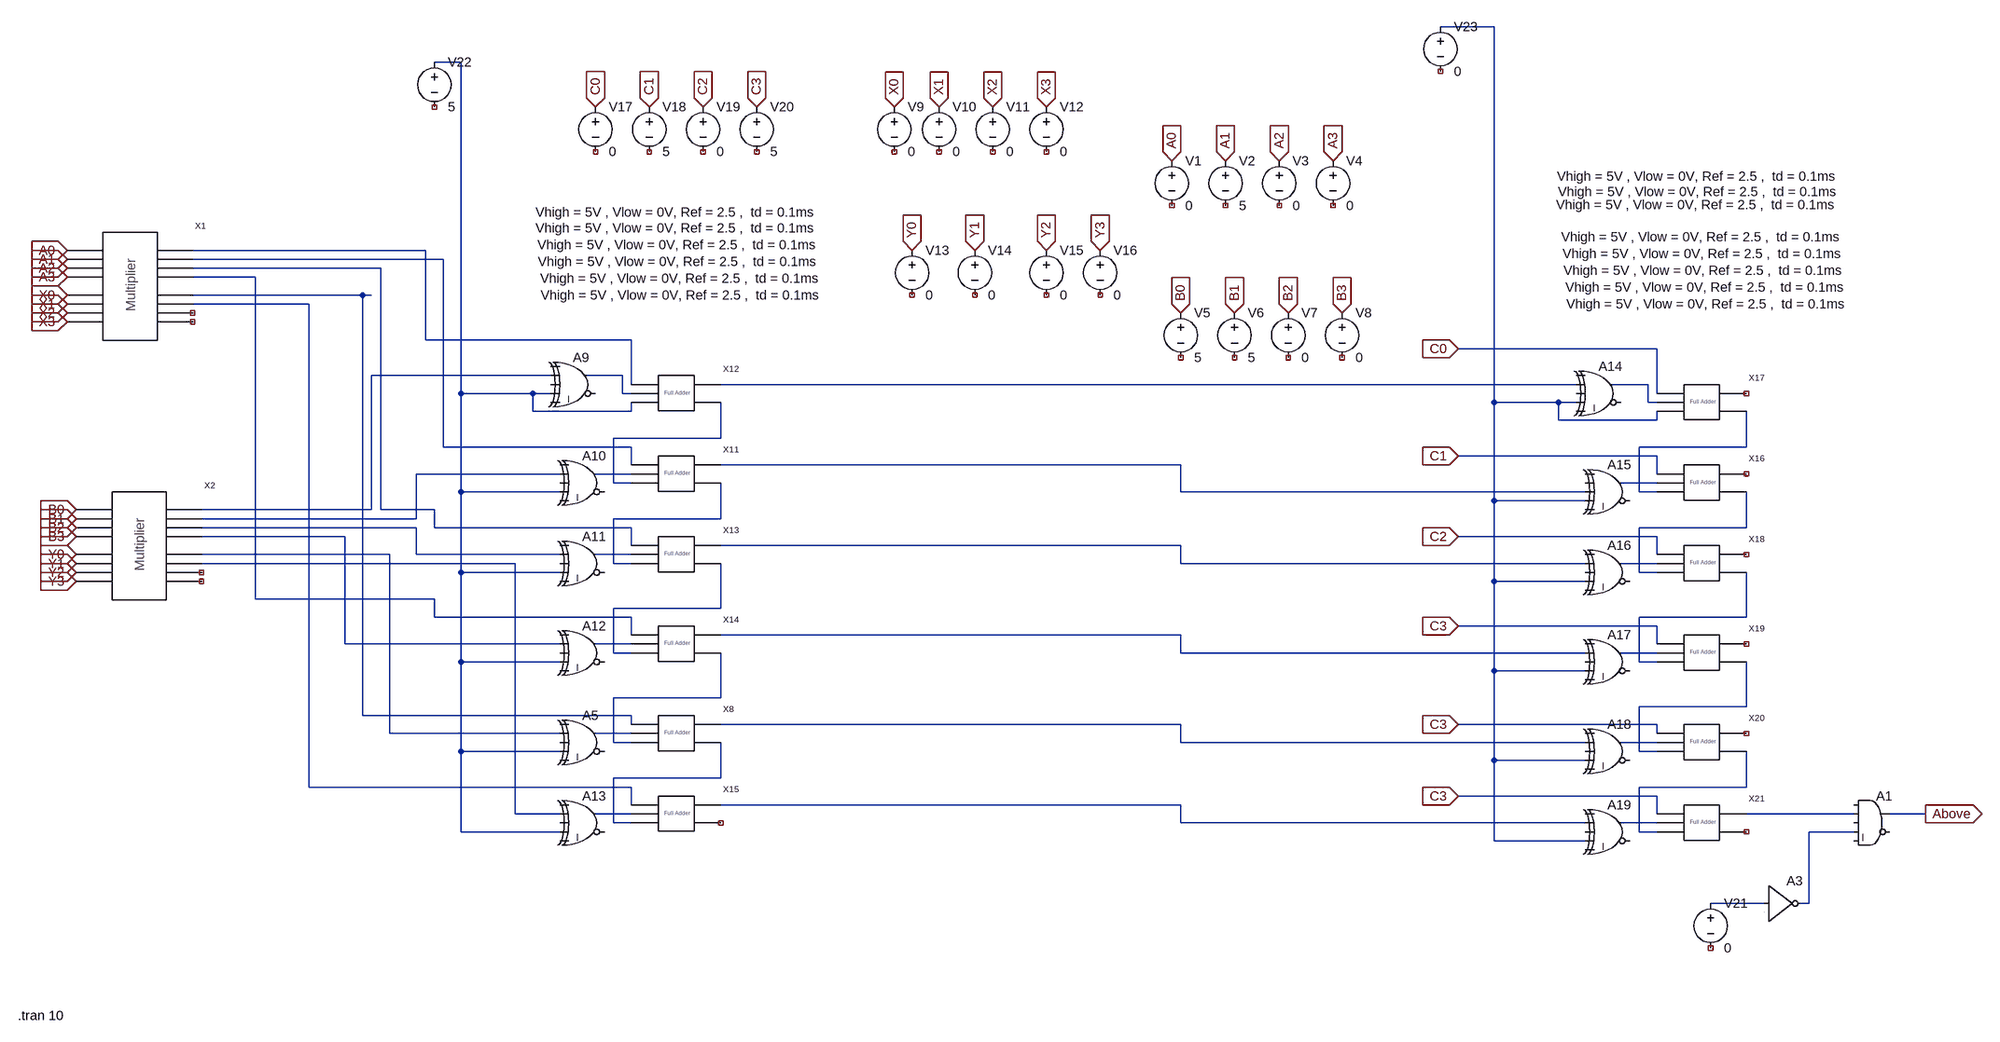
[diagram p0: schematic pattern_recognation.asc]
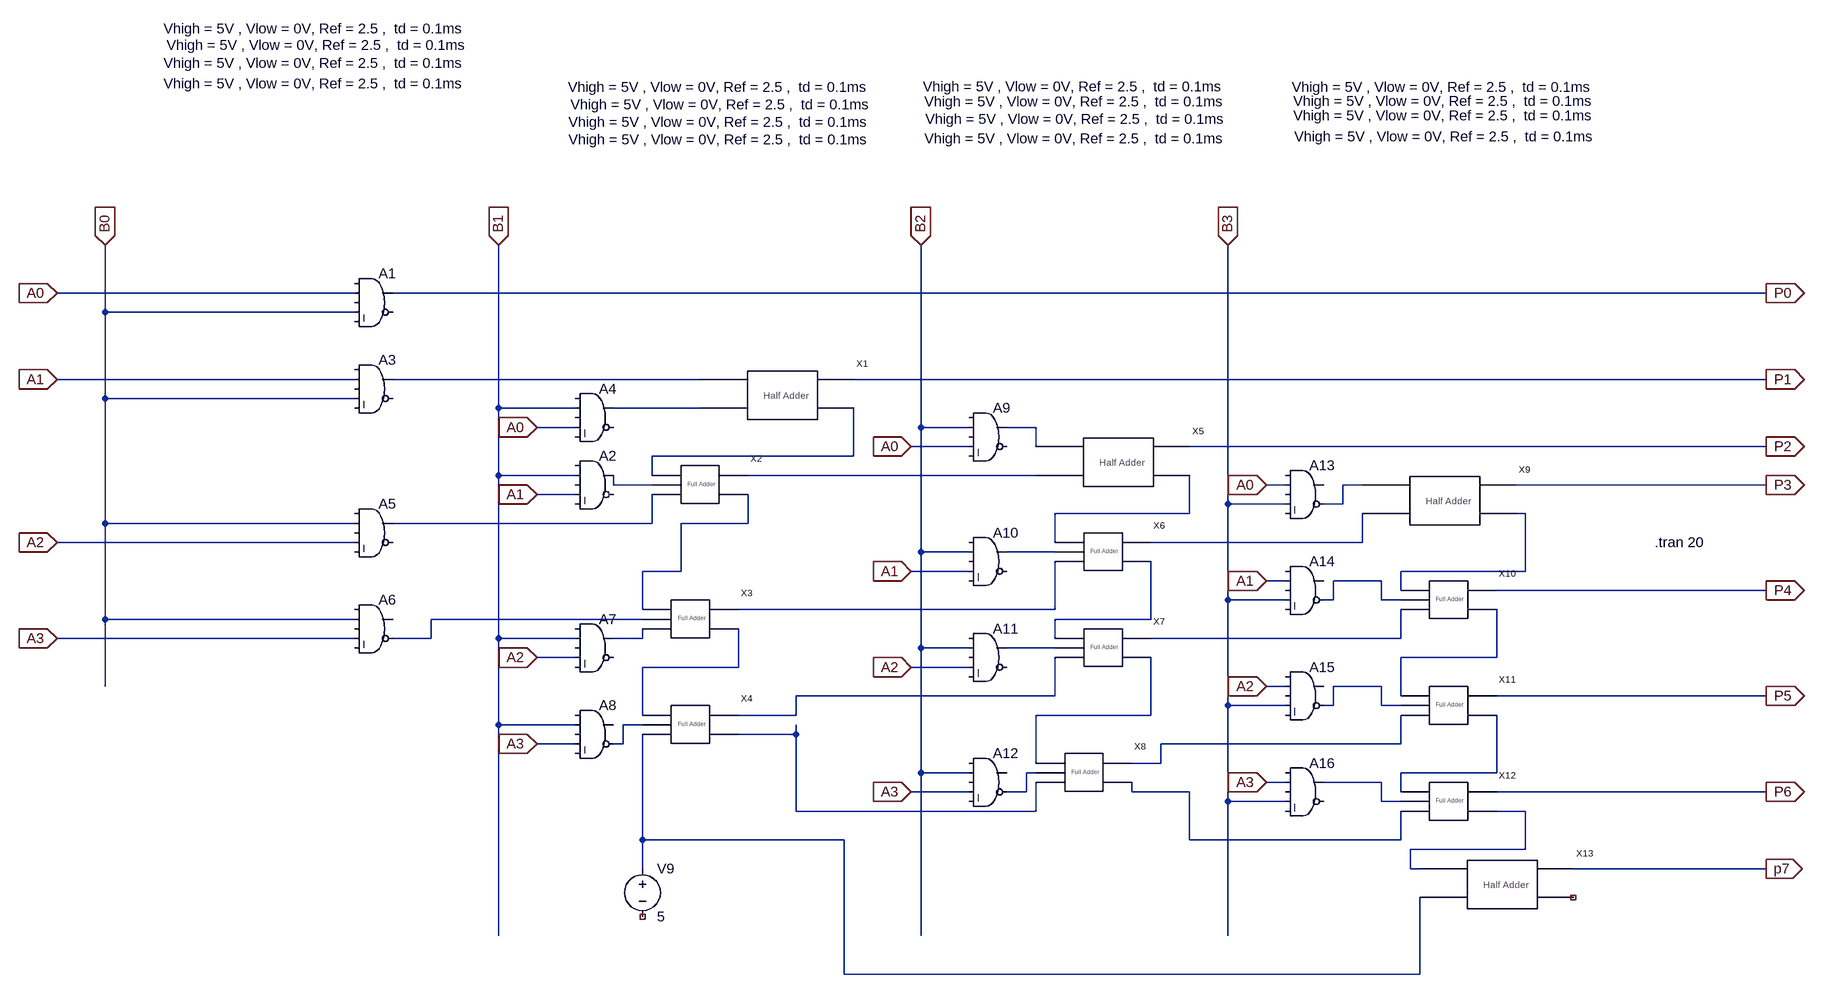
[diagram p1: sub-circuit multiplier-signed.asc]
pattern_recognation.asc, the LTspice schematic file:
Version 4
SHEET 1 5140 1704
WIRE 1088 -464 992 -464
WIRE -896 -400 -944 -400
WIRE -960 -64 -1376 -64
WIRE -928 -48 -1376 -48
WIRE -1040 -32 -1376 -32
WIRE -1264 -16 -1376 -16
WIRE -1072 16 -1376 16
WIRE -1056 16 -1072 16
WIRE -1168 32 -1376 32
WIRE -960 96 -960 -64
WIRE -592 96 -960 96
WIRE 1392 112 1024 112
WIRE -736 160 -1056 160
WIRE -608 160 -672 160
WIRE -592 176 -592 96
WIRE 1248 176 -432 176
WIRE 1376 176 1312 176
WIRE -896 192 -896 -400
WIRE -768 192 -896 192
WIRE -736 192 -768 192
WIRE -608 192 -608 160
WIRE -592 192 -608 192
WIRE 1392 192 1392 112
WIRE 1088 208 1088 -464
WIRE 1216 208 1088 208
WIRE 1248 208 1216 208
WIRE 1376 208 1376 176
WIRE 1392 208 1376 208
WIRE -768 224 -768 192
WIRE -592 224 -592 208
WIRE -592 224 -768 224
WIRE 1216 240 1216 208
WIRE 1392 240 1392 224
WIRE 1392 240 1216 240
WIRE -432 272 -432 208
WIRE -432 272 -624 272
WIRE -928 288 -928 -48
WIRE -592 288 -928 288
WIRE 1552 288 1552 224
WIRE 1552 288 1360 288
WIRE 1392 304 1024 304
WIRE -592 320 -592 288
WIRE 528 320 -432 320
WIRE -720 336 -976 336
WIRE -592 336 -656 336
WIRE 1392 336 1392 304
WIRE -624 352 -624 272
WIRE -592 352 -624 352
WIRE 1392 352 1328 352
WIRE -896 368 -896 192
WIRE -720 368 -896 368
WIRE 528 368 528 320
WIRE 1264 368 528 368
WIRE 1360 368 1360 288
WIRE 1392 368 1360 368
WIRE 1088 384 1088 208
WIRE 1264 384 1088 384
WIRE -1056 400 -1056 160
WIRE -1056 400 -1360 400
WIRE -1040 400 -1040 -32
WIRE -944 400 -1040 400
WIRE -976 416 -976 336
WIRE -976 416 -1360 416
WIRE -432 416 -432 352
WIRE -432 416 -624 416
WIRE -976 432 -1360 432
WIRE -944 432 -944 400
WIRE -592 432 -944 432
WIRE 1552 432 1552 368
WIRE 1552 432 1360 432
WIRE -1104 448 -1360 448
WIRE 1392 448 1024 448
WIRE -592 464 -592 432
WIRE 528 464 -432 464
WIRE -1024 480 -1360 480
WIRE -976 480 -976 432
WIRE -720 480 -976 480
WIRE -592 480 -656 480
WIRE 1392 480 1392 448
WIRE -800 496 -1360 496
WIRE -624 496 -624 416
WIRE -592 496 -624 496
WIRE 528 496 528 464
WIRE 1264 496 528 496
WIRE 1392 496 1328 496
WIRE -896 512 -896 368
WIRE -720 512 -896 512
WIRE 1360 512 1360 432
WIRE 1392 512 1360 512
WIRE 1088 528 1088 384
WIRE 1264 528 1088 528
WIRE -1264 560 -1264 -16
WIRE -944 560 -1264 560
WIRE -432 576 -432 496
WIRE -432 576 -624 576
WIRE -944 592 -944 560
WIRE -592 592 -944 592
WIRE 1552 592 1552 512
WIRE 1552 592 1360 592
WIRE 1392 608 1024 608
WIRE -592 624 -592 592
WIRE 528 624 -432 624
WIRE -1104 640 -1104 448
WIRE -720 640 -1104 640
WIRE -592 640 -656 640
WIRE 1392 640 1392 608
WIRE -624 656 -624 576
WIRE -592 656 -624 656
WIRE 528 656 528 624
WIRE 1264 656 528 656
WIRE 1392 656 1328 656
WIRE -896 672 -896 512
WIRE -720 672 -896 672
WIRE 1360 672 1360 592
WIRE 1392 672 1360 672
WIRE 1088 688 1088 528
WIRE 1264 688 1088 688
WIRE -432 736 -432 656
WIRE -432 736 -624 736
WIRE 1552 752 1552 672
WIRE 1552 752 1360 752
WIRE -1072 768 -1072 16
WIRE -592 768 -1072 768
WIRE -592 784 -592 768
WIRE 528 784 -432 784
WIRE 1392 784 1024 784
WIRE -1024 800 -1024 480
WIRE -720 800 -1024 800
WIRE -592 800 -656 800
WIRE 1392 800 1392 784
WIRE -624 816 -624 736
WIRE -592 816 -624 816
WIRE 528 816 528 784
WIRE 1264 816 528 816
WIRE 1392 816 1328 816
WIRE -896 832 -896 672
WIRE -720 832 -896 832
WIRE 1360 832 1360 752
WIRE 1392 832 1360 832
WIRE 1088 848 1088 688
WIRE 1264 848 1088 848
WIRE -432 880 -432 816
WIRE -432 880 -624 880
WIRE -1168 896 -1168 32
WIRE -592 896 -1168 896
WIRE 1552 896 1552 832
WIRE 1552 896 1360 896
WIRE 1392 912 1024 912
WIRE -592 928 -592 896
WIRE 528 928 -432 928
WIRE -800 944 -800 496
WIRE -720 944 -800 944
WIRE -592 944 -656 944
WIRE 1392 944 1392 912
WIRE 1744 944 1552 944
WIRE 1872 944 1808 944
WIRE -624 960 -624 880
WIRE -592 960 -624 960
WIRE 528 960 528 928
WIRE 1264 960 528 960
WIRE 1392 960 1328 960
WIRE -896 976 -896 832
WIRE -720 976 -896 976
WIRE 1360 976 1360 896
WIRE 1392 976 1360 976
WIRE 1744 976 1664 976
WIRE 1088 992 1088 848
WIRE 1264 992 1088 992
WIRE 1584 1104 1488 1104
WIRE 1664 1104 1664 976
WIRE 1664 1104 1648 1104
FLAG 1024 112 C0
IOPIN 1024 112 In
FLAG 1024 304 C1
IOPIN 1024 304 In
FLAG 1024 448 C2
IOPIN 1024 448 In
FLAG 1024 608 C3
IOPIN 1024 608 In
FLAG 1024 784 C3
IOPIN 1024 784 In
FLAG 1024 912 C3
IOPIN 1024 912 In
FLAG -368 -320 C3
IOPIN -368 -320 In
FLAG -464 -320 C2
IOPIN -464 -320 In
FLAG -560 -320 C1
IOPIN -560 -320 In
FLAG -656 -320 C0
IOPIN -656 -320 In
FLAG 800 -224 A3
IOPIN 800 -224 In
FLAG 704 -224 A2
IOPIN 704 -224 In
FLAG 608 -224 A1
IOPIN 608 -224 In
FLAG 512 -224 A0
IOPIN 512 -224 In
FLAG -1600 -16 A3
IOPIN -1600 -16 In
FLAG -1600 -32 A2
IOPIN -1600 -32 In
FLAG -1600 -48 A1
IOPIN -1600 -48 In
FLAG -1600 -64 A0
IOPIN -1600 -64 In
FLAG 816 48 B3
IOPIN 816 48 In
FLAG 720 48 B2
IOPIN 720 48 In
FLAG 624 48 B1
IOPIN 624 48 In
FLAG 528 48 B0
IOPIN 528 48 In
FLAG 288 -320 X3
IOPIN 288 -320 In
FLAG 192 -320 X2
IOPIN 192 -320 In
FLAG 96 -320 X1
IOPIN 96 -320 In
FLAG 16 -320 X0
IOPIN 16 -320 In
FLAG 384 -64 Y3
IOPIN 384 -64 In
FLAG 288 -64 Y2
IOPIN 288 -64 In
FLAG 160 -64 Y1
IOPIN 160 -64 In
FLAG 48 -64 Y0
IOPIN 48 -64 In
FLAG -1600 64 X3
IOPIN -1600 64 In
FLAG -1600 48 X2
IOPIN -1600 48 In
FLAG -1600 32 X1
IOPIN -1600 32 In
FLAG -1600 16 X0
IOPIN -1600 16 In
FLAG -1584 448 B3
IOPIN -1584 448 In
FLAG -1584 432 B2
IOPIN -1584 432 In
FLAG -1584 416 B1
IOPIN -1584 416 In
FLAG -1584 400 B0
IOPIN -1584 400 In
FLAG -1584 528 Y3
IOPIN -1584 528 In
FLAG -1584 512 Y2
IOPIN -1584 512 In
FLAG -1584 496 Y1
IOPIN -1584 496 In
FLAG -1584 480 Y0
IOPIN -1584 480 In
FLAG 1872 944 Above
IOPIN 1872 944 Out
SYMBOL multiplier-signed -1472 -32 R0
SYMATTR InstName X1
SYMBOL multiplier-signed -1456 432 R0
SYMATTR InstName X2
SYMBOL full_adder -512 336 R0
SYMATTR InstName X11
SYMBOL full_adder -512 192 R0
SYMATTR InstName X12
SYMBOL Digital\\xor -688 112 R0
WINDOW 3 -75 -216 Left 2
SYMATTR Value Vhigh = 5V , Vlow = 0V, Ref = 2.5 ,  td = 0.1ms
SYMATTR InstName A9
SYMBOL Digital\\xor -672 288 R0
WINDOW 3 -88 -362 Left 2
SYMATTR Value Vhigh = 5V , Vlow = 0V, Ref = 2.5 ,  td = 0.1ms
SYMATTR InstName A10
SYMBOL full_adder -512 480 R0
SYMATTR InstName X13
SYMBOL Digital\\xor -672 432 R0
WINDOW 3 -87 -476 Left 2
SYMATTR Value Vhigh = 5V , Vlow = 0V, Ref = 2.5 ,  td = 0.1ms
SYMATTR InstName A11
SYMBOL full_adder -512 640 R0
SYMATTR InstName X14
SYMBOL Digital\\xor -672 592 R0
WINDOW 3 -83 -606 Left 2
SYMATTR Value Vhigh = 5V , Vlow = 0V, Ref = 2.5 ,  td = 0.1ms
SYMATTR InstName A12
SYMBOL full_adder -512 800 R0
SYMATTR InstName X8
SYMBOL Digital\\xor -672 752 R0
WINDOW 3 -82 -736 Left 2
SYMATTR Value Vhigh = 5V , Vlow = 0V, Ref = 2.5 ,  td = 0.1ms
SYMATTR InstName A5
SYMBOL full_adder -512 944 R0
SYMATTR InstName X15
SYMBOL Digital\\xor -672 896 R0
WINDOW 3 -91 -1028 Left 2
SYMATTR Value Vhigh = 5V , Vlow = 0V, Ref = 2.5 ,  td = 0.1ms
SYMATTR InstName A13
SYMBOL full_adder 1472 352 R0
SYMATTR InstName X16
SYMBOL full_adder 1472 208 R0
SYMATTR InstName X17
SYMBOL Digital\\xor 1296 128 R0
WINDOW 3 -75 -216 Left 2
SYMATTR Value Vhigh = 5V , Vlow = 0V, Ref = 2.5 ,  td = 0.1ms
SYMATTR InstName A14
SYMBOL Digital\\xor 1312 304 R0
WINDOW 3 -88 -362 Left 2
SYMATTR Value Vhigh = 5V , Vlow = 0V, Ref = 2.5 ,  td = 0.1ms
SYMATTR InstName A15
SYMBOL full_adder 1472 496 R0
SYMATTR InstName X18
SYMBOL Digital\\xor 1312 448 R0
WINDOW 3 -87 -476 Left 2
SYMATTR Value Vhigh = 5V , Vlow = 0V, Ref = 2.5 ,  td = 0.1ms
SYMATTR InstName A16
SYMBOL full_adder 1472 656 R0
SYMATTR InstName X19
SYMBOL Digital\\xor 1312 608 R0
WINDOW 3 -83 -606 Left 2
SYMATTR Value Vhigh = 5V , Vlow = 0V, Ref = 2.5 ,  td = 0.1ms
SYMATTR InstName A17
SYMBOL full_adder 1472 816 R0
SYMATTR InstName X20
SYMBOL Digital\\xor 1312 768 R0
WINDOW 3 -82 -736 Left 2
SYMATTR Value Vhigh = 5V , Vlow = 0V, Ref = 2.5 ,  td = 0.1ms
SYMATTR InstName A18
SYMBOL full_adder 1472 960 R0
SYMATTR InstName X21
SYMBOL Digital\\xor 1312 912 R0
WINDOW 3 -98 -1108 Left 2
SYMATTR Value Vhigh = 5V , Vlow = 0V, Ref = 2.5 ,  td = 0.1ms
SYMATTR InstName A19
SYMBOL Digital\\and 1776 896 R0
WINDOW 3 -561 -1065 Left 2
SYMATTR InstName A1
SYMATTR Value Vhigh = 5V , Vlow = 0V, Ref = 2.5 ,  td = 0.1ms
SYMBOL voltage 512 -240 R0
WINDOW 123 0 0 Left 0
WINDOW 39 0 0 Left 0
SYMATTR InstName V1
SYMATTR Value 0
SYMBOL voltage 608 -240 R0
WINDOW 123 0 0 Left 0
WINDOW 39 0 0 Left 0
SYMATTR InstName V2
SYMATTR Value 5
SYMBOL voltage 704 -240 R0
WINDOW 123 0 0 Left 0
WINDOW 39 0 0 Left 0
SYMATTR InstName V3
SYMATTR Value 0
SYMBOL voltage 800 -240 R0
WINDOW 123 0 0 Left 0
WINDOW 39 0 0 Left 0
SYMATTR InstName V4
SYMATTR Value 0
SYMBOL voltage 528 32 R0
WINDOW 123 0 0 Left 0
WINDOW 39 0 0 Left 0
SYMATTR InstName V5
SYMATTR Value 5
SYMBOL voltage 624 32 R0
WINDOW 123 0 0 Left 0
WINDOW 39 0 0 Left 0
SYMATTR InstName V6
SYMATTR Value 5
SYMBOL voltage 720 32 R0
WINDOW 123 0 0 Left 0
WINDOW 39 0 0 Left 0
SYMATTR InstName V7
SYMATTR Value 0
SYMBOL voltage 816 32 R0
WINDOW 123 0 0 Left 0
WINDOW 39 0 0 Left 0
SYMATTR InstName V8
SYMATTR Value 0
SYMBOL voltage 16 -336 R0
WINDOW 123 0 0 Left 0
WINDOW 39 0 0 Left 0
SYMATTR InstName V9
SYMATTR Value 0
SYMBOL voltage 96 -336 R0
WINDOW 123 0 0 Left 0
WINDOW 39 0 0 Left 0
SYMATTR InstName V10
SYMATTR Value 0
SYMBOL voltage 192 -336 R0
WINDOW 123 0 0 Left 0
WINDOW 39 0 0 Left 0
SYMATTR InstName V11
SYMATTR Value 0
SYMBOL voltage 288 -336 R0
WINDOW 123 0 0 Left 0
WINDOW 39 0 0 Left 0
SYMATTR InstName V12
SYMATTR Value 0
SYMBOL voltage 48 -80 R0
WINDOW 123 0 0 Left 0
WINDOW 39 0 0 Left 0
SYMATTR InstName V13
SYMATTR Value 0
SYMBOL voltage 160 -80 R0
WINDOW 123 0 0 Left 0
WINDOW 39 0 0 Left 0
SYMATTR InstName V14
SYMATTR Value 0
SYMBOL voltage 288 -80 R0
WINDOW 123 0 0 Left 0
WINDOW 39 0 0 Left 0
SYMATTR InstName V15
SYMATTR Value 0
SYMBOL voltage 384 -80 R0
WINDOW 123 0 0 Left 0
WINDOW 39 0 0 Left 0
SYMATTR InstName V16
SYMATTR Value 0
SYMBOL voltage -656 -336 R0
WINDOW 123 0 0 Left 0
WINDOW 39 0 0 Left 0
SYMATTR InstName V17
SYMATTR Value 0
SYMBOL voltage -560 -336 R0
WINDOW 123 0 0 Left 0
WINDOW 39 0 0 Left 0
SYMATTR InstName V18
SYMATTR Value 5
SYMBOL voltage -464 -336 R0
WINDOW 123 0 0 Left 0
WINDOW 39 0 0 Left 0
SYMATTR InstName V19
SYMATTR Value 0
SYMBOL voltage -368 -336 R0
WINDOW 123 0 0 Left 0
WINDOW 39 0 0 Left 0
SYMATTR InstName V20
SYMATTR Value 5
SYMBOL voltage 1488 1088 R0
WINDOW 123 0 0 Left 0
WINDOW 39 0 0 Left 0
SYMATTR InstName V21
SYMATTR Value 0
SYMBOL voltage -944 -416 R0
WINDOW 123 0 0 Left 0
WINDOW 39 0 0 Left 0
SYMATTR InstName V22
SYMATTR Value 5
SYMBOL voltage 992 -480 R0
WINDOW 123 0 0 Left 0
WINDOW 39 0 0 Left 0
SYMATTR InstName V23
SYMATTR Value 0
SYMBOL Digital\\inv 1584 1040 R0
WINDOW 3 -372 -1185 Left 2
SYMATTR InstName A3
SYMATTR Value Vhigh = 5V , Vlow = 0V, Ref = 2.5 ,  td = 0.1ms
TEXT -1688 1668 Left 2 !.tran 10

multiplier-signed.asc, the sub-circuit schematic file:
Version 4
SHEET 1 3064 760
WIRE 224 -736 -272 -736
WIRE 2976 -736 288 -736
WIRE -192 -704 -192 -816
WIRE 224 -704 -192 -704
WIRE 224 -592 -272 -592
WIRE 800 -592 288 -592
WIRE 2976 -592 1056 -592
WIRE -192 -560 -192 -704
WIRE 224 -560 -192 -560
WIRE 464 -544 464 -816
WIRE 592 -544 464 -544
WIRE 800 -544 656 -544
WIRE 592 -512 528 -512
WIRE 1168 -512 1168 -816
WIRE 1248 -512 1168 -512
WIRE 1360 -512 1312 -512
WIRE 1248 -480 1152 -480
WIRE 1360 -480 1360 -512
WIRE 2976 -480 1616 -480
WIRE 1056 -464 1056 -544
WIRE 1056 -464 720 -464
WIRE 464 -432 464 -544
WIRE 592 -432 464 -432
WIRE 720 -432 720 -464
WIRE 1360 -432 880 -432
WIRE 656 -416 656 -432
WIRE 720 -416 656 -416
WIRE 1776 -416 1744 -416
WIRE 1904 -416 1872 -416
WIRE 2976 -416 2160 -416
WIRE 592 -400 528 -400
WIRE 1680 -384 1680 -816
WIRE 1776 -384 1680 -384
WIRE 1872 -384 1872 -416
WIRE 1872 -384 1840 -384
WIRE 1616 -368 1616 -432
WIRE 1616 -368 1392 -368
WIRE 2176 -368 2160 -368
WIRE -192 -352 -192 -560
WIRE 224 -352 -192 -352
WIRE 720 -352 720 -400
WIRE 720 -352 288 -352
WIRE 880 -352 880 -400
WIRE 880 -352 768 -352
WIRE 224 -320 -272 -320
WIRE 1392 -320 1392 -368
WIRE 1904 -320 1904 -368
WIRE 1904 -320 1552 -320
WIRE 1168 -304 1168 -512
WIRE 1248 -304 1168 -304
WIRE 1392 -304 1312 -304
WIRE 768 -272 768 -352
WIRE 768 -272 704 -272
WIRE 1248 -272 1152 -272
WIRE 2176 -272 2176 -368
WIRE 2176 -272 1968 -272
WIRE 1776 -256 1744 -256
WIRE 1936 -256 1856 -256
WIRE 1968 -240 1968 -272
WIRE 2976 -240 2128 -240
WIRE 1680 -224 1680 -384
WIRE 1776 -224 1680 -224
WIRE 1856 -224 1856 -256
WIRE 1856 -224 1840 -224
WIRE 1936 -224 1936 -256
WIRE 1968 -224 1936 -224
WIRE 704 -208 704 -272
WIRE 1392 -208 1392 -288
WIRE 1392 -208 864 -208
WIRE -192 -192 -192 -352
WIRE 224 -192 -192 -192
WIRE 704 -192 352 -192
WIRE 1552 -192 1552 -288
WIRE 1552 -192 1392 -192
WIRE 224 -160 -272 -160
WIRE 352 -160 352 -192
WIRE 352 -160 288 -160
WIRE 464 -160 464 -432
WIRE 592 -160 464 -160
WIRE 704 -160 704 -176
WIRE 704 -160 656 -160
WIRE 1392 -160 1392 -192
WIRE 1968 -160 1968 -208
WIRE 1968 -160 1552 -160
WIRE 1168 -144 1168 -304
WIRE 1248 -144 1168 -144
WIRE 1392 -144 1312 -144
WIRE 592 -128 528 -128
WIRE 2128 -128 2128 -208
WIRE 2128 -128 1968 -128
WIRE 864 -112 864 -176
WIRE 864 -112 704 -112
WIRE 1248 -112 1152 -112
WIRE -192 -80 -192 -192
WIRE 1776 -80 1744 -80
WIRE 1936 -80 1856 -80
WIRE 1392 -64 1392 -128
WIRE 1392 -64 960 -64
WIRE 1968 -64 1968 -128
WIRE 2976 -64 2128 -64
WIRE 1680 -48 1680 -224
WIRE 1776 -48 1680 -48
WIRE 1856 -48 1856 -80
WIRE 1856 -48 1840 -48
WIRE 1936 -48 1936 -80
WIRE 1968 -48 1936 -48
WIRE 704 -32 704 -112
WIRE 960 -32 960 -64
WIRE 960 -32 864 -32
WIRE 1552 -32 1552 -128
WIRE 1552 -32 1360 -32
WIRE 464 -16 464 -160
WIRE 592 -16 464 -16
WIRE 704 -16 672 -16
WIRE 960 0 960 -16
WIRE 960 0 864 0
WIRE 592 16 528 16
WIRE 672 16 672 -16
WIRE 672 16 656 16
WIRE 1968 16 1968 -32
WIRE 1968 16 1568 16
WIRE 1360 48 1360 -32
WIRE 1568 48 1568 16
WIRE 1568 48 1520 48
WIRE 1168 64 1168 -144
WIRE 1248 64 1168 64
WIRE 1360 64 1344 64
WIRE 2128 64 2128 -32
WIRE 2128 64 1968 64
WIRE 1776 80 1744 80
WIRE 1936 80 1840 80
WIRE 1248 96 1152 96
WIRE 1344 96 1344 64
WIRE 1344 96 1312 96
WIRE 1520 96 1520 80
WIRE 1616 96 1520 96
WIRE 1968 96 1968 64
WIRE 2976 96 2128 96
WIRE 1680 112 1680 -48
WIRE 1776 112 1680 112
WIRE 1936 112 1936 80
WIRE 1968 112 1936 112
WIRE 960 128 960 0
WIRE 1360 128 1360 80
WIRE 1360 128 960 128
WIRE 2176 128 2128 128
WIRE 704 176 704 0
WIRE 1040 176 704 176
WIRE 1616 176 1616 96
WIRE 1968 176 1968 128
WIRE 1968 176 1616 176
WIRE 2176 192 2176 128
WIRE 2176 192 1984 192
WIRE 704 224 704 176
WIRE 1984 224 1984 192
WIRE 2000 224 1984 224
WIRE 2976 224 2256 224
WIRE 464 336 464 -16
WIRE 1168 336 1168 64
WIRE 1680 336 1680 112
WIRE 1040 400 1040 176
WIRE 2000 400 2000 272
WIRE 2000 400 1040 400
FLAG -272 -736 A0
IOPIN -272 -736 In
FLAG -272 -592 A1
IOPIN -272 -592 In
FLAG 1152 -480 A0
IOPIN 1152 -480 In
FLAG -272 -160 A3
IOPIN -272 -160 In
FLAG 528 -512 A0
IOPIN 528 -512 In
FLAG 528 -400 A1
IOPIN 528 -400 In
FLAG -272 -320 A2
IOPIN -272 -320 In
FLAG 528 -128 A2
IOPIN 528 -128 In
FLAG 528 16 A3
IOPIN 528 16 In
FLAG 1152 -272 A1
IOPIN 1152 -272 In
FLAG 1152 -112 A2
IOPIN 1152 -112 In
FLAG 1152 96 A3
IOPIN 1152 96 In
FLAG 1744 -416 A0
IOPIN 1744 -416 In
FLAG 1744 -256 A1
IOPIN 1744 -256 In
FLAG 1744 -80 A2
IOPIN 1744 -80 In
FLAG 1744 80 A3
IOPIN 1744 80 In
FLAG -192 -816 B0
IOPIN -192 -816 In
FLAG 464 -816 B1
IOPIN 464 -816 In
FLAG 1168 -816 B2
IOPIN 1168 -816 In
FLAG 2976 -736 P0
IOPIN 2976 -736 Out
FLAG 2976 -592 P1
IOPIN 2976 -592 Out
FLAG 2976 -480 P2
IOPIN 2976 -480 Out
FLAG 2976 -416 P3
IOPIN 2976 -416 Out
FLAG 2976 -240 P4
IOPIN 2976 -240 Out
FLAG 2976 -64 P5
IOPIN 2976 -64 Out
FLAG 2976 96 P6
IOPIN 2976 96 Out
FLAG 1680 -816 B3
IOPIN 1680 -816 In
FLAG 2976 224 p7
IOPIN 2976 224 Out
DATAFLAG 1216 -512 "$-V(B3)"
SYMBOL Digital\\and 256 -784 R0
WINDOW 3 -350 -335 Left 2
SYMATTR Value Vhigh = 5V , Vlow = 0V, Ref = 2.5 ,  td = 0.1ms
SYMATTR InstName A1
SYMBOL Digital\\and 624 -480 R0
WINDOW 3 -40 -570 Left 2
SYMATTR Value Vhigh = 5V , Vlow = 0V, Ref = 2.5 ,  td = 0.1ms
SYMATTR InstName A2
SYMBOL Digital\\and 256 -640 R0
WINDOW 3 -350 -445 Left 2
SYMATTR Value Vhigh = 5V , Vlow = 0V, Ref = 2.5 ,  td = 0.1ms
SYMATTR InstName A3
SYMBOL Digital\\and 624 -592 R0
WINDOW 3 -44 -487 Left 2
SYMATTR Value Vhigh = 5V , Vlow = 0V, Ref = 2.5 ,  td = 0.1ms
SYMATTR InstName A4
SYMBOL half_adder 944 -560 R0
SYMATTR InstName X1
SYMBOL full_adder 800 -416 R0
SYMATTR InstName X2
SYMBOL Digital\\and 256 -400 R0
WINDOW 3 -345 -749 Left 2
SYMATTR Value Vhigh = 5V , Vlow = 0V, Ref = 2.5 ,  td = 0.1ms
SYMATTR InstName A5
SYMBOL Digital\\and 256 -240 R0
WINDOW 3 -350 -937 Left 2
SYMATTR Value Vhigh = 5V , Vlow = 0V, Ref = 2.5 ,  td = 0.1ms
SYMATTR InstName A6
SYMBOL full_adder 784 -192 R0
SYMATTR InstName X3
SYMBOL Digital\\and 624 -208 R0
WINDOW 3 -43 -813 Left 2
SYMATTR Value Vhigh = 5V , Vlow = 0V, Ref = 2.5 ,  td = 0.1ms
SYMATTR InstName A7
SYMBOL Digital\\and 624 -64 R0
WINDOW 3 -43 -928 Left 2
SYMATTR Value Vhigh = 5V , Vlow = 0V, Ref = 2.5 ,  td = 0.1ms
SYMATTR InstName A8
SYMBOL Digital\\and 1280 -560 R0
WINDOW 3 -106 -433 Left 2
SYMATTR Value Vhigh = 5V , Vlow = 0V, Ref = 2.5 ,  td = 0.1ms
SYMATTR InstName A9
SYMBOL half_adder 1504 -448 R0
SYMATTR InstName X5
SYMBOL Digital\\and 1280 -352 R0
WINDOW 3 -104 -674 Left 2
SYMATTR Value Vhigh = 5V , Vlow = 0V, Ref = 2.5 ,  td = 0.1ms
SYMATTR InstName A10
SYMBOL full_adder 1472 -304 R0
SYMATTR InstName X6
SYMBOL Digital\\and 1280 -192 R0
WINDOW 3 -106 -863 Left 2
SYMATTR Value Vhigh = 5V , Vlow = 0V, Ref = 2.5 ,  td = 0.1ms
SYMATTR InstName A11
SYMBOL full_adder 1472 -144 R0
SYMATTR InstName X7
SYMBOL Digital\\and 1280 16 R0
WINDOW 3 -108 -1096 Left 2
SYMATTR Value Vhigh = 5V , Vlow = 0V, Ref = 2.5 ,  td = 0.1ms
SYMATTR InstName A12
SYMBOL Digital\\and 1808 -464 R0
WINDOW 3 -17 -533 Left 2
SYMATTR Value Vhigh = 5V , Vlow = 0V, Ref = 2.5 ,  td = 0.1ms
SYMATTR InstName A13
SYMBOL half_adder 2048 -384 R0
SYMATTR InstName X9
SYMBOL Digital\\and 1808 -304 R0
WINDOW 3 -19 -728 Left 2
SYMATTR Value Vhigh = 5V , Vlow = 0V, Ref = 2.5 ,  td = 0.1ms
SYMATTR InstName A14
SYMBOL full_adder 2048 -224 R0
SYMATTR InstName X10
SYMBOL Digital\\and 1808 -128 R0
WINDOW 3 -19 -928 Left 2
SYMATTR Value Vhigh = 5V , Vlow = 0V, Ref = 2.5 ,  td = 0.1ms
SYMATTR InstName A15
SYMBOL full_adder 2048 -48 R0
SYMATTR InstName X11
SYMBOL Digital\\and 1808 32 R0
WINDOW 3 -21 -1111 Left 2
SYMATTR Value Vhigh = 5V , Vlow = 0V, Ref = 2.5 ,  td = 0.1ms
SYMATTR InstName A16
SYMBOL full_adder 2048 112 R0
SYMATTR InstName X12
SYMBOL full_adder 1440 64 R0
SYMATTR InstName X8
SYMBOL full_adder 784 -16 R0
SYMATTR InstName X4
SYMBOL voltage 704 208 R0
WINDOW 123 0 0 Left 0
WINDOW 39 0 0 Left 0
SYMATTR InstName V9
SYMATTR Value 5
SYMBOL half_adder 2144 256 R0
SYMATTR InstName X13
TEXT 2768 -320 Left 2 !.tran 20

The netlist it stands for:
* pattern_recognation.asc
XX1 A0 A1 A2 A3 X0 X1 X2 X3 N003 N004 N005 N006 N007 N008 NC_01 NC_02 multiplier-signed
XX2 B0 B1 B2 B3 Y0 Y1 Y2 Y3 N009 N016 N020 N022 N024 N026 NC_03 NC_04 multiplier-signed
XX11 N004 N017 N013 N019 N015 full_adder  ; pins A B Cin Cout Sum
XX12 N003 N010 N002 N013 N011 full_adder  ; pins A B Cin Cout Sum
A9 0 N009 0 N002 0 0 N010 0 XOR Vhigh = 5V , Vlow = 0V, Ref = 2.5 ,  td = 0.1ms
A10 0 N016 0 N002 0 0 N017 0 XOR Vhigh = 5V , Vlow = 0V, Ref = 2.5 ,  td = 0.1ms
XX13 N005 N025 N019 N028 N023 full_adder  ; pins A B Cin Cout Sum
A11 0 N020 0 N002 0 0 N025 0 XOR Vhigh = 5V , Vlow = 0V, Ref = 2.5 ,  td = 0.1ms
XX14 N006 N031 N028 N033 N030 full_adder  ; pins A B Cin Cout Sum
A12 0 N022 0 N002 0 0 N031 0 XOR Vhigh = 5V , Vlow = 0V, Ref = 2.5 ,  td = 0.1ms
XX8 N007 N036 N033 N038 N035 full_adder  ; pins A B Cin Cout Sum
A5 0 N024 0 N002 0 0 N036 0 XOR Vhigh = 5V , Vlow = 0V, Ref = 2.5 ,  td = 0.1ms
XX15 N008 N041 N038 NC_05 N040 full_adder  ; pins A B Cin Cout Sum
A13 0 N026 0 N002 0 0 N041 0 XOR Vhigh = 5V , Vlow = 0V, Ref = 2.5 ,  td = 0.1ms
XX16 C1 N018 N014 N021 NC_06 full_adder  ; pins A B Cin Cout Sum
XX17 C0 N012 N001 N014 NC_07 full_adder  ; pins A B Cin Cout Sum
A14 0 N011 0 N001 0 0 N012 0 XOR Vhigh = 5V , Vlow = 0V, Ref = 2.5 ,  td = 0.1ms
A15 0 0 N015 N001 0 0 N018 0 XOR Vhigh = 5V , Vlow = 0V, Ref = 2.5 ,  td = 0.1ms
XX18 C2 N027 N021 N029 NC_08 full_adder  ; pins A B Cin Cout Sum
A16 0 N023 0 N001 0 0 N027 0 XOR Vhigh = 5V , Vlow = 0V, Ref = 2.5 ,  td = 0.1ms
XX19 C3 N032 N029 N034 NC_09 full_adder  ; pins A B Cin Cout Sum
A17 0 N030 0 N001 0 0 N032 0 XOR Vhigh = 5V , Vlow = 0V, Ref = 2.5 ,  td = 0.1ms
XX20 C3 N037 N034 N039 NC_10 full_adder  ; pins A B Cin Cout Sum
A18 0 N035 0 N001 0 0 N037 0 XOR Vhigh = 5V , Vlow = 0V, Ref = 2.5 ,  td = 0.1ms
XX21 C3 N043 N039 NC_11 N042 full_adder  ; pins A B Cin Cout Sum
A19 0 N040 0 N001 0 0 N043 0 XOR Vhigh = 5V , Vlow = 0V, Ref = 2.5 ,  td = 0.1ms
A1 0 N042 0 N044 0 0 Above 0 AND Vhigh = 5V , Vlow = 0V, Ref = 2.5 ,  td = 0.1ms
V1 A0 NC_12 0
V2 A1 NC_13 5
V3 A2 NC_14 0
V4 A3 NC_15 0
V5 B0 NC_16 5
V6 B1 NC_17 5
V7 B2 NC_18 0
V8 B3 NC_19 0
V9 X0 NC_20 0
V10 X1 NC_21 0
V11 X2 NC_22 0
V12 X3 NC_23 0
V13 Y0 NC_24 0
V14 Y1 NC_25 0
V15 Y2 NC_26 0
V16 Y3 NC_27 0
V17 C0 NC_28 0
V18 C1 NC_29 5
V19 C2 NC_30 0
V20 C3 NC_31 5
V21 N045 NC_32 0
V22 N002 NC_33 5
V23 N001 NC_34 0
A3 N045 0 0 0 0 N044 0 0 BUF Vhigh = 5V , Vlow = 0V, Ref = 2.5 ,  td = 0.1ms

* block symbol definitions
.subckt multiplier-signed A0 A1 A2 A3 B0 B1 B2 B3 P0 P1 P2 P3 P4 P5 P6 P7
A1 0 A0 0 B0 0 0 P0 0 AND Vhigh = 5V , Vlow = 0V, Ref = 2.5 ,  td = 0.1ms
A2 0 B1 0 A1 0 0 N006 0 AND Vhigh = 5V , Vlow = 0V, Ref = 2.5 ,  td = 0.1ms
A3 0 A1 0 B0 0 0 N001 0 AND Vhigh = 5V , Vlow = 0V, Ref = 2.5 ,  td = 0.1ms
A4 0 B1 0 A0 0 0 N002 0 AND Vhigh = 5V , Vlow = 0V, Ref = 2.5 ,  td = 0.1ms
XX1 N001 N002 P1 N004 half_adder  ; pins A B Sum carry
XX2 N004 N006 N010 N011 N005 full_adder  ; pins A B Cin Cout Sum
A5 0 B0 0 A2 0 0 N010 0 AND Vhigh = 5V , Vlow = 0V, Ref = 2.5 ,  td = 0.1ms
A6 0 B0 0 A3 0 N016 0 0 AND Vhigh = 5V , Vlow = 0V, Ref = 2.5 ,  td = 0.1ms
XX3 N011 N016 N018 N022 N015 full_adder  ; pins A B Cin Cout Sum
A7 0 B1 0 A2 0 0 N018 0 AND Vhigh = 5V , Vlow = 0V, Ref = 2.5 ,  td = 0.1ms
A8 0 B1 0 A3 0 N026 0 0 AND Vhigh = 5V , Vlow = 0V, Ref = 2.5 ,  td = 0.1ms
A9 0 B2 0 A0 0 0 N003 0 AND Vhigh = 5V , Vlow = 0V, Ref = 2.5 ,  td = 0.1ms
XX5 N003 N005 P2 N008 half_adder  ; pins A B Sum carry
A10 0 B2 0 A1 0 0 N013 0 AND Vhigh = 5V , Vlow = 0V, Ref = 2.5 ,  td = 0.1ms
XX6 N008 N013 N015 N017 N012 full_adder  ; pins A B Cin Cout Sum
A11 0 B2 0 A2 0 0 N020 0 AND Vhigh = 5V , Vlow = 0V, Ref = 2.5 ,  td = 0.1ms
XX7 N017 N020 N024 N025 N019 full_adder  ; pins A B Cin Cout Sum
A12 0 B2 0 A3 0 N029 0 0 AND Vhigh = 5V , Vlow = 0V, Ref = 2.5 ,  td = 0.1ms
A13 0 A0 0 B3 0 N007 0 0 AND Vhigh = 5V , Vlow = 0V, Ref = 2.5 ,  td = 0.1ms
XX9 N007 N012 P3 N009 half_adder  ; pins A B Sum carry
A14 0 A1 0 B3 0 N014 0 0 AND Vhigh = 5V , Vlow = 0V, Ref = 2.5 ,  td = 0.1ms
XX10 N009 N014 N019 N021 P4 full_adder  ; pins A B Cin Cout Sum
A15 0 A2 0 B3 0 N023 0 0 AND Vhigh = 5V , Vlow = 0V, Ref = 2.5 ,  td = 0.1ms
XX11 N021 N023 N028 N030 P5 full_adder  ; pins A B Cin Cout Sum
A16 0 A3 0 B3 0 0 N031 0 AND Vhigh = 5V , Vlow = 0V, Ref = 2.5 ,  td = 0.1ms
XX12 N030 N031 N032 N033 P6 full_adder  ; pins A B Cin Cout Sum
XX8 N025 N029 N027 N032 N028 full_adder  ; pins A B Cin Cout Sum
XX4 N022 N026 N034 N027 N024 full_adder  ; pins A B Cin Cout Sum
V9 N034 NC_01 5
XX13 N033 N034 p7 NC_02 half_adder  ; pins A B Sum carry
.tran 20
.ends multiplier-signed

.tran 10
.backanno
.end